# Altium schematic sheet Grid.SchDoc
size 203 x 228 mm; SheetNumber: 3; SheetTotal: 4
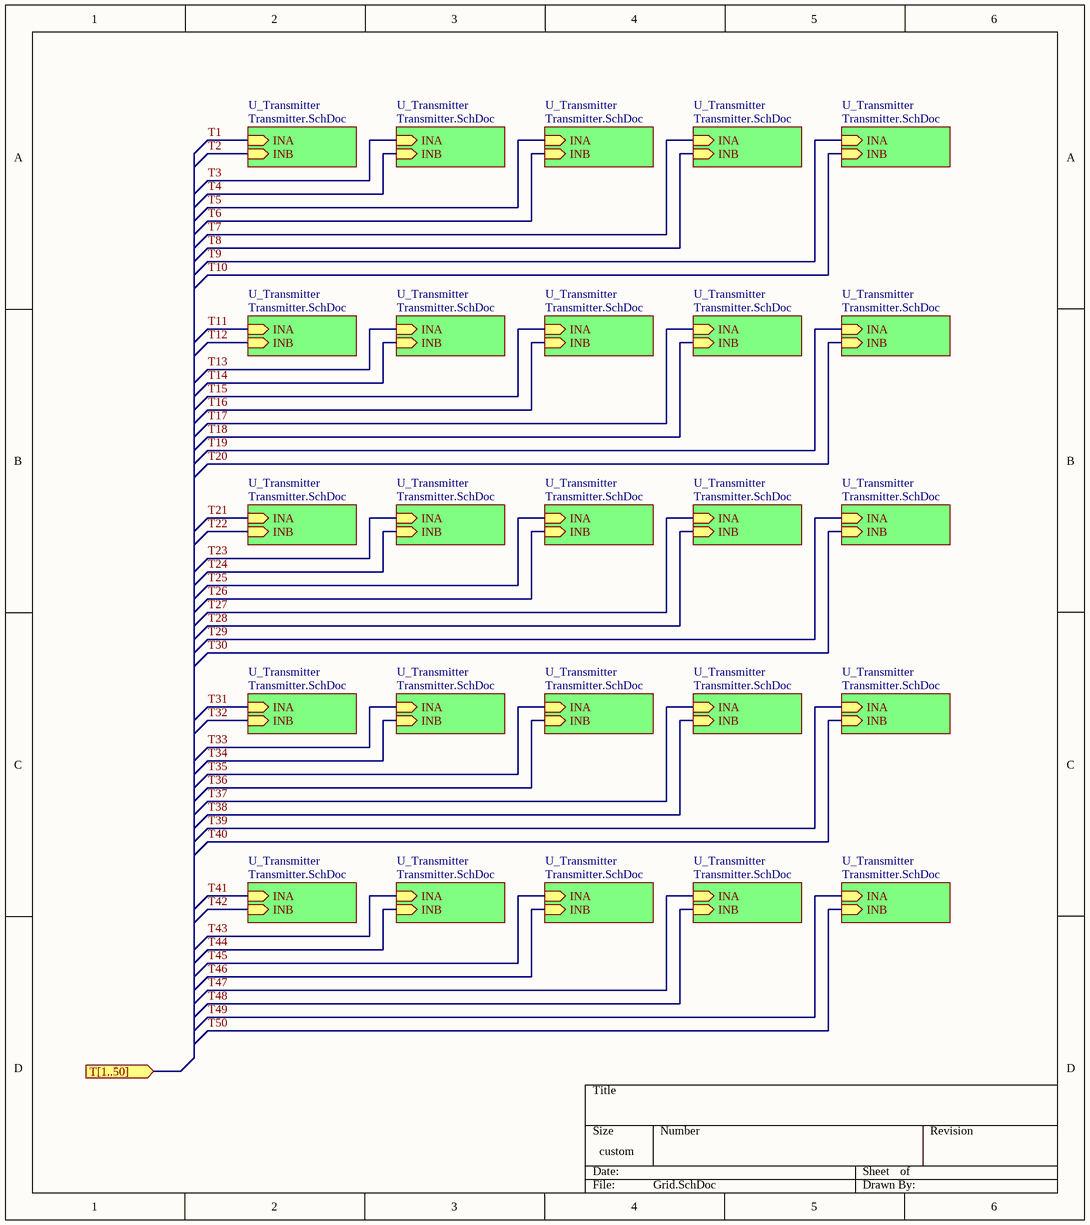
[diagram p0: Grid.SchDoc]

## Sub-sheets
U_Transmitter = Transmitter.SchDoc: INA (in), INB (in)
U_Transmitter = Transmitter.SchDoc: INA (in), INB (in)
U_Transmitter = Transmitter.SchDoc: INA (in), INB (in)
U_Transmitter = Transmitter.SchDoc: INA (in), INB (in)
U_Transmitter = Transmitter.SchDoc: INA (in), INB (in)
U_Transmitter = Transmitter.SchDoc: INA (in), INB (in)
U_Transmitter = Transmitter.SchDoc: INA (in), INB (in)
U_Transmitter = Transmitter.SchDoc: INA (in), INB (in)
U_Transmitter = Transmitter.SchDoc: INA (in), INB (in)
U_Transmitter = Transmitter.SchDoc: INA (in), INB (in)
U_Transmitter = Transmitter.SchDoc: INA (in), INB (in)
U_Transmitter = Transmitter.SchDoc: INA (in), INB (in)
U_Transmitter = Transmitter.SchDoc: INA (in), INB (in)
U_Transmitter = Transmitter.SchDoc: INA (in), INB (in)
U_Transmitter = Transmitter.SchDoc: INA (in), INB (in)
U_Transmitter = Transmitter.SchDoc: INA (in), INB (in)
U_Transmitter = Transmitter.SchDoc: INA (in), INB (in)
U_Transmitter = Transmitter.SchDoc: INA (in), INB (in)
U_Transmitter = Transmitter.SchDoc: INA (in), INB (in)
U_Transmitter = Transmitter.SchDoc: INA (in), INB (in)
U_Transmitter = Transmitter.SchDoc: INA (in), INB (in)
U_Transmitter = Transmitter.SchDoc: INA (in), INB (in)
U_Transmitter = Transmitter.SchDoc: INA (in), INB (in)
U_Transmitter = Transmitter.SchDoc: INA (in), INB (in)
U_Transmitter = Transmitter.SchDoc: INA (in), INB (in)

## Ports
T[1..50] (in)

## Nets
T1: sheet U_Transmitter/INA
T2: sheet U_Transmitter/INB
T3: sheet U_Transmitter/INA
T4: sheet U_Transmitter/INB
T5: sheet U_Transmitter/INA
T6: sheet U_Transmitter/INB
T7: sheet U_Transmitter/INA
T8: sheet U_Transmitter/INB
T9: sheet U_Transmitter/INA
T10: sheet U_Transmitter/INB
T11: sheet U_Transmitter/INA
T12: sheet U_Transmitter/INB
T13: sheet U_Transmitter/INA
T14: sheet U_Transmitter/INB
T15: sheet U_Transmitter/INA
T16: sheet U_Transmitter/INB
T17: sheet U_Transmitter/INA
T18: sheet U_Transmitter/INB
T19: sheet U_Transmitter/INA
T20: sheet U_Transmitter/INB
T21: sheet U_Transmitter/INA
T22: sheet U_Transmitter/INB
T23: sheet U_Transmitter/INA
T24: sheet U_Transmitter/INB
T25: sheet U_Transmitter/INA
T26: sheet U_Transmitter/INB
T27: sheet U_Transmitter/INA
T28: sheet U_Transmitter/INB
T29: sheet U_Transmitter/INA
T30: sheet U_Transmitter/INB
T31: sheet U_Transmitter/INA
T32: sheet U_Transmitter/INB
T33: sheet U_Transmitter/INA
T34: sheet U_Transmitter/INB
T35: sheet U_Transmitter/INA
T36: sheet U_Transmitter/INB
T37: sheet U_Transmitter/INA
T38: sheet U_Transmitter/INB
T39: sheet U_Transmitter/INA
T40: sheet U_Transmitter/INB
T41: sheet U_Transmitter/INA
T42: sheet U_Transmitter/INB
T43: sheet U_Transmitter/INA
T44: sheet U_Transmitter/INB
T45: sheet U_Transmitter/INA
T46: sheet U_Transmitter/INB
T47: sheet U_Transmitter/INA
T48: sheet U_Transmitter/INB
T49: sheet U_Transmitter/INA
T50: sheet U_Transmitter/INB